# EAGLE schematic working (EAGLE 7.7.0)

## Sheet 1 of 2
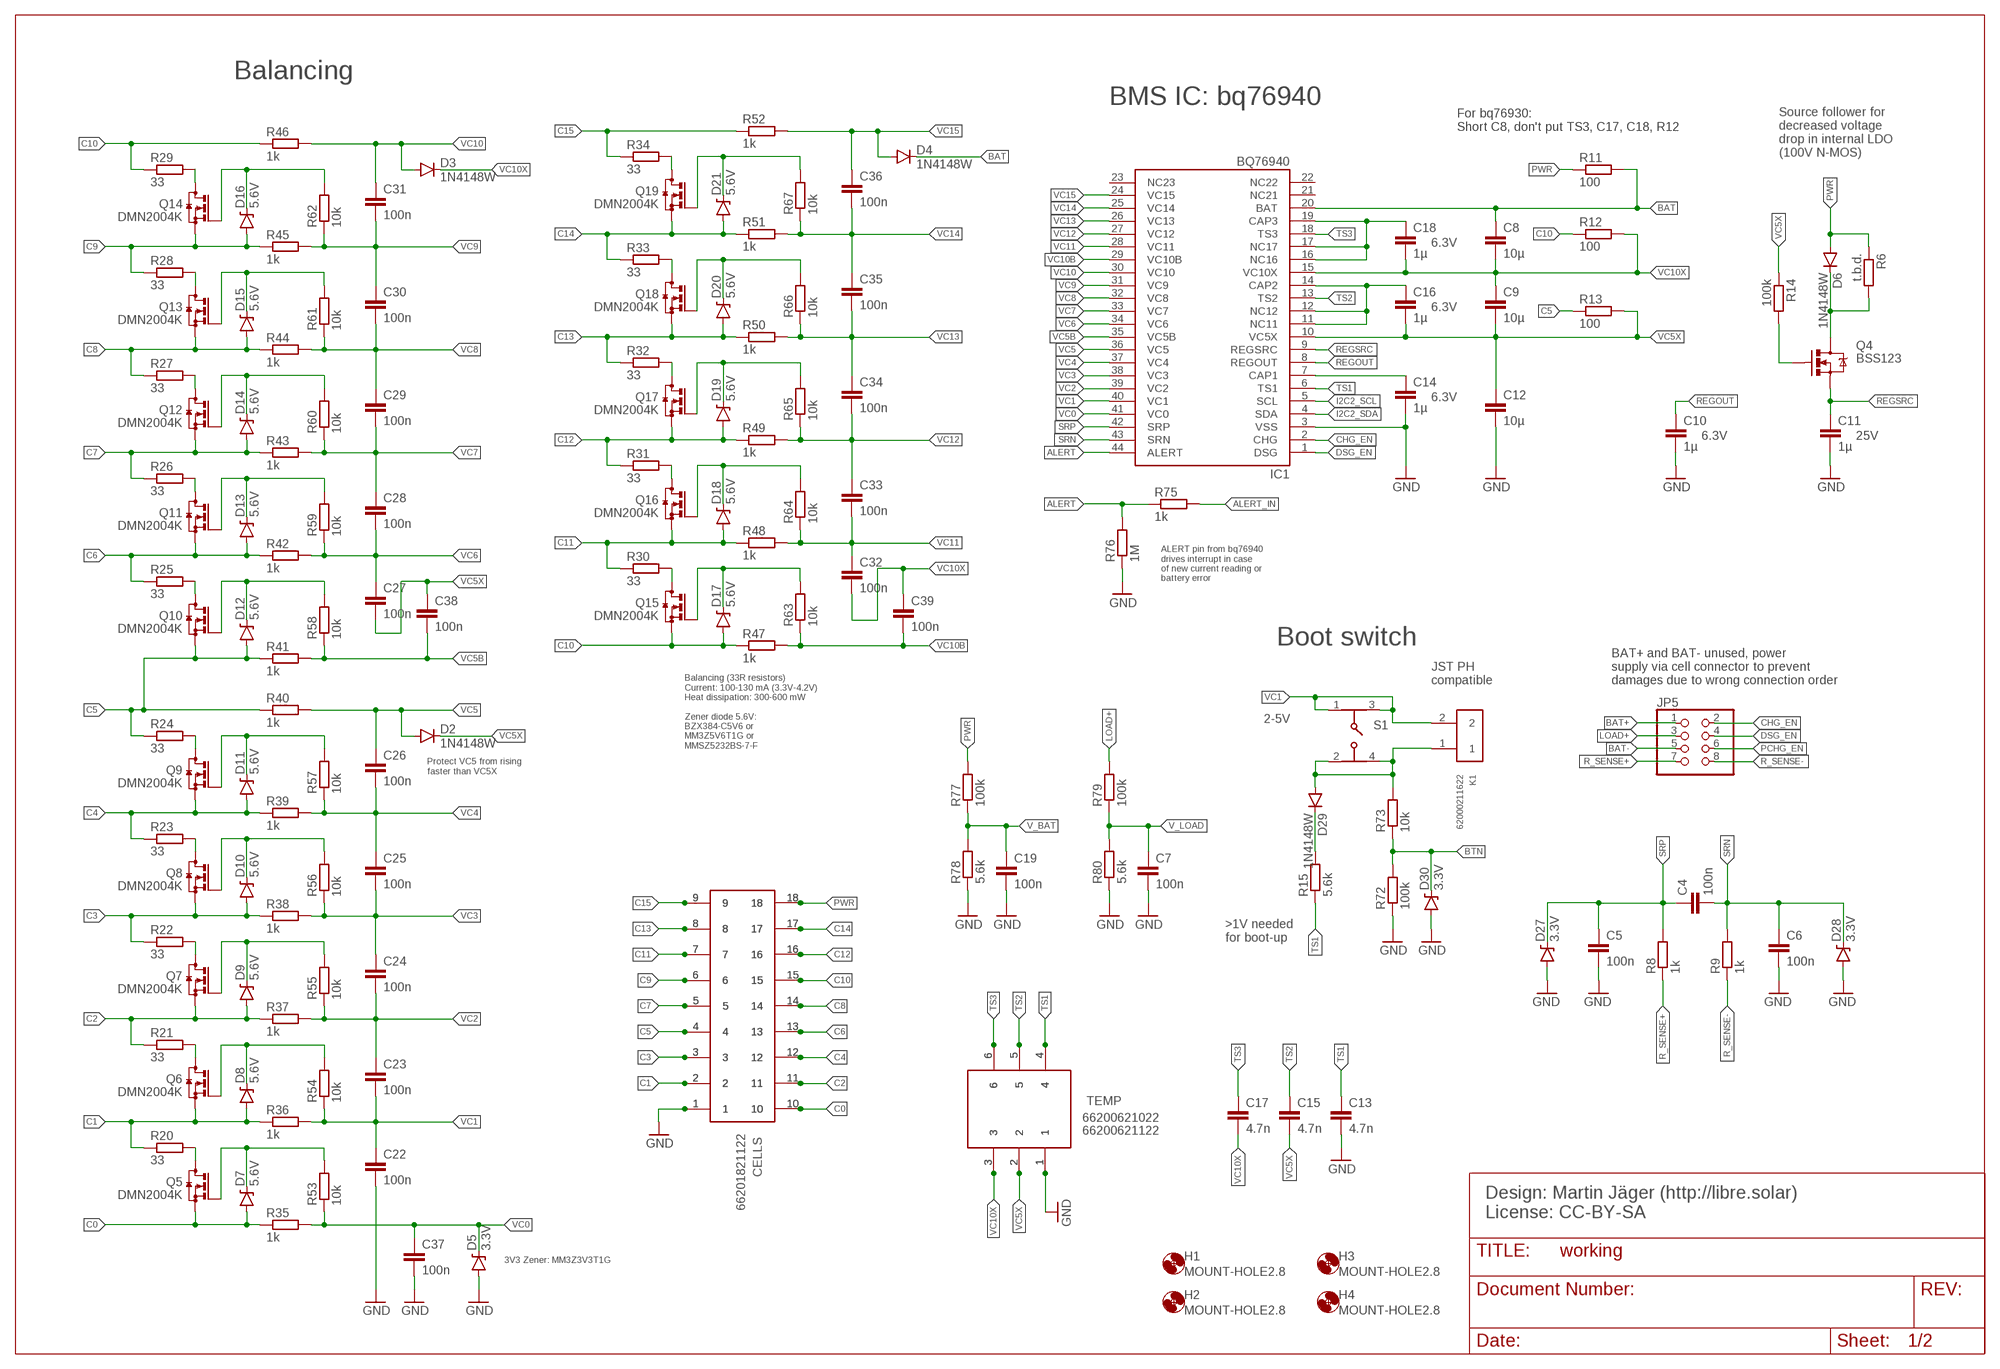
[diagram p0: schematic, sheet 1]

### Parts
C4  100n  C-EUC0603  [C0603]
C5  100n  C-EUC0603  [C0603]
C6  100n  C-EUC0603  [C0603]
C7  100n  C-EUC0603  [C0603]
C8  10µ  C-EUC1210  [C1210]
C9  10µ  C-EUC1210  [C1210]
C10  1µ  C-EUC0603  [C0603]
C11  1µ  C-EUC0603  [C0603]
C12  10µ  C-EUC1210  [C1210]
C13  4.7n  C-EUC0603  [C0603]
C14  1µ  C-EUC0603  [C0603]
C15  4.7n  C-EUC0603  [C0603]
C16  1µ  C-EUC0603  [C0603]
C17  4.7n  C-EUC0603  [C0603]
C18  1µ  C-EUC0603  [C0603]
C19  100n  C-EUC0603  [C0603]
C22  100n  C-EUC0603  [C0603]
C23  100n  C-EUC0603  [C0603]
C24  100n  C-EUC0603  [C0603]
C25  100n  C-EUC0603  [C0603]
C26  100n  C-EUC0603  [C0603]
C27  100n  C-EUC0603  [C0603]
C28  100n  C-EUC0603  [C0603]
C29  100n  C-EUC0603  [C0603]
C30  100n  C-EUC0603  [C0603]
C31  100n  C-EUC0603  [C0603]
C32  100n  C-EUC0603  [C0603]
C33  100n  C-EUC0603  [C0603]
C34  100n  C-EUC0603  [C0603]
C35  100n  C-EUC0603  [C0603]
C36  100n  C-EUC0603  [C0603]
C37  100n  C-EUC0603  [C0603]
C38  100n  C-EUC0603  [C0603]
C39  100n  C-EUC0603  [C0603]
CELLS  66201821022  [66201821022]
D2  1N4148W  DIODESOD123  [SOD-123]
D3  1N4148W  DIODESOD123  [SOD-123]
D4  1N4148W  DIODESOD123  [SOD-123]
D5  3.3V  DIODE-ZENER5.6V  [SOD-323]
D6  1N4148W  DIODESOD123  [SOD-123]
D7  5.6V  DIODE-ZENER5.6V  [SOD-323]
D8  5.6V  DIODE-ZENER5.6V  [SOD-323]
D9  5.6V  DIODE-ZENER5.6V  [SOD-323]
D10  5.6V  DIODE-ZENER5.6V  [SOD-323]
D11  5.6V  DIODE-ZENER5.6V  [SOD-323]
D12  5.6V  DIODE-ZENER5.6V  [SOD-323]
D13  5.6V  DIODE-ZENER5.6V  [SOD-323]
D14  5.6V  DIODE-ZENER5.6V  [SOD-323]
D15  5.6V  DIODE-ZENER5.6V  [SOD-323]
D16  5.6V  DIODE-ZENER5.6V  [SOD-323]
D17  5.6V  DIODE-ZENER5.6V  [SOD-323]
D18  5.6V  DIODE-ZENER5.6V  [SOD-323]
D19  5.6V  DIODE-ZENER5.6V  [SOD-323]
D20  5.6V  DIODE-ZENER5.6V  [SOD-323]
D21  5.6V  DIODE-ZENER5.6V  [SOD-323]
D27  3.3V  DIODE-ZENER5.6V  [SOD-323]
D28  3.3V  DIODE-ZENER5.6V  [SOD-323]
D29  1N4148W  DIODESOD123  [SOD-123]
D30  3.3V  DIODE-ZENER5.6V  [SOD-323]
H1  MOUNT-HOLE2.8  [2,8]
H2  MOUNT-HOLE2.8  [2,8]
H3  MOUNT-HOLE2.8  [2,8]
H4  MOUNT-HOLE2.8  [2,8]
IC1  BQ76940  [TSSOP44]
JP5  PINHD-2X4  [2X04]
K1  62000211622  [62000211622]
K4  66200621122  [66200621122]
K5  66201821122  [66201821122]
Q4  BSS123  MOSFET-NCHANNELBSS138  [SOT23-3]
Q5  DMN2004K  [SOT23]
Q6  DMN2004K  [SOT23]
Q7  DMN2004K  [SOT23]
Q8  DMN2004K  [SOT23]
Q9  DMN2004K  [SOT23]
Q10  DMN2004K  [SOT23]
Q11  DMN2004K  [SOT23]
Q12  DMN2004K  [SOT23]
Q13  DMN2004K  [SOT23]
Q14  DMN2004K  [SOT23]
Q15  DMN2004K  [SOT23]
Q16  DMN2004K  [SOT23]
Q17  DMN2004K  [SOT23]
Q18  DMN2004K  [SOT23]
Q19  DMN2004K  [SOT23]
R6  t.b.d.  R-EU_R0603  [R0603]
R8  1k  R-EU_R0603  [R0603]
R9  1k  R-EU_R0603  [R0603]
R11  100  R-EU_R0603  [R0603]
R12  100  R-EU_R0603  [R0603]
R13  100  R-EU_R0603  [R0603]
R14  100k  R-EU_R0603  [R0603]
R15  5.6k  R-EU_R0603  [R0603]
R20  33  R-EU_R2010  [R2010]
R21  33  R-EU_R2010  [R2010]
R22  33  R-EU_R2010  [R2010]
R23  33  R-EU_R2010  [R2010]
R24  33  R-EU_R2010  [R2010]
R25  33  R-EU_R2010  [R2010]
R26  33  R-EU_R2010  [R2010]
R27  33  R-EU_R2010  [R2010]
R28  33  R-EU_R2010  [R2010]
R29  33  R-EU_R2010  [R2010]
R30  33  R-EU_R2010  [R2010]
R31  33  R-EU_R2010  [R2010]
R32  33  R-EU_R2010  [R2010]
R33  33  R-EU_R2010  [R2010]
R34  33  R-EU_R2010  [R2010]
R35  1k  R-EU_R0603  [R0603]
R36  1k  R-EU_R0603  [R0603]
R37  1k  R-EU_R0603  [R0603]
R38  1k  R-EU_R0603  [R0603]
R39  1k  R-EU_R0603  [R0603]
R40  1k  R-EU_R0603  [R0603]
R41  1k  R-EU_R0603  [R0603]
R42  1k  R-EU_R0603  [R0603]
R43  1k  R-EU_R0603  [R0603]
R44  1k  R-EU_R0603  [R0603]
R45  1k  R-EU_R0603  [R0603]
R46  1k  R-EU_R0603  [R0603]
R47  1k  R-EU_R0603  [R0603]
R48  1k  R-EU_R0603  [R0603]
R49  1k  R-EU_R0603  [R0603]
R50  1k  R-EU_R0603  [R0603]
R51  1k  R-EU_R0603  [R0603]
R52  1k  R-EU_R0603  [R0603]
R53  10k  R-EU_R0603  [R0603]
R54  10k  R-EU_R0603  [R0603]
R55  10k  R-EU_R0603  [R0603]
R56  10k  R-EU_R0603  [R0603]
R57  10k  R-EU_R0603  [R0603]
R58  10k  R-EU_R0603  [R0603]
R59  10k  R-EU_R0603  [R0603]
R60  10k  R-EU_R0603  [R0603]
R61  10k  R-EU_R0603  [R0603]
R62  10k  R-EU_R0603  [R0603]
R63  10k  R-EU_R0603  [R0603]
R64  10k  R-EU_R0603  [R0603]
R65  10k  R-EU_R0603  [R0603]
R66  10k  R-EU_R0603  [R0603]
R67  10k  R-EU_R0603  [R0603]
R72  100k  R-EU_R0603  [R0603]
R73  10k  R-EU_R0603  [R0603]
R75  1k  R-EU_R0603  [R0603]
R76  1M  R-EU_R0603  [R0603]
R77  100k  R-EU_R0603  [R0603]
R78  5.6k  R-EU_R0603  [R0603]
R79  100k  R-EU_R0603  [R0603]
R80  5.6k  R-EU_R0603  [R0603]
S1  430182050816  [430182050816]
TEMP  66200621022  [66200621022]

### Nets
ALERT: IC1.44(ALERT) R75.1 R76.2
ALERT_IN: R75.2 ; also sheet 2
BAT: C8.1 D4.C IC1.20(BAT) R11.2
BAT+: JP5.1
BAT-: JP5.5
BTN: D30.C R72.2 R73.1 ; also sheet 2
C0: CELLS.10 D7.A K5.10 Q5.2(S) R35.1
C1: CELLS.2 D8.A K5.2 Q6.2(S) R20.1 R36.1
C2: CELLS.11 D9.A K5.11 Q7.2(S) R21.1 R37.1
C3: CELLS.3 D10.A K5.3 Q8.2(S) R22.1 R38.1
C4: CELLS.12 D11.A K5.12 Q9.2(S) R23.1 R39.1
C5: CELLS.4 D12.A K5.4 Q10.2(S) R13.1 R24.1 R40.1 R41.1
C6: CELLS.13 D13.A K5.13 Q11.2(S) R25.1 R42.1
C7: CELLS.5 D14.A K5.5 Q12.2(S) R26.1 R43.1
C8: CELLS.14 D15.A K5.14 Q13.2(S) R27.1 R44.1
C9: CELLS.6 D16.A K5.6 Q14.2(S) R28.1 R45.1
C10: CELLS.15 D17.A K5.15 Q15.2(S) R12.1 R29.1 R46.1 R47.1
C11: CELLS.7 D18.A K5.7 Q16.2(S) R30.1 R48.1
C12: CELLS.16 D19.A K5.16 Q17.2(S) R31.1 R49.1
C13: CELLS.8 D20.A K5.8 Q18.2(S) R32.1 R50.1
C14: CELLS.17 D21.A K5.17 Q19.2(S) R33.1 R51.1
C15: CELLS.9 K5.9 R34.1 R52.1
CAP1: C14.1 IC1.7(CAP1)
CAP2: C16.1 IC1.11(NC11) IC1.12(NC12) IC1.14(CAP2)
CAP3: C18.1 IC1.16(NC16) IC1.17(NC17) IC1.19(CAP3)
CHG_EN: IC1.2(CHG) JP5.2
DSG_EN: IC1.1(DSG) JP5.4
GND [power]: C5.2 C6.2 C7.2 C10.2 C11.2 C12.2 C13.2 C14.2 C19.2 C22.2 C37.2 CELLS.1 D5.A D27.A D28.A D30.A IC1.3(VSS) K4.1 K5.1 R72.1 R76.1 R78.1 R80.1 TEMP.1 ; also sheet 2
I2C2_SCL: IC1.5(SCL) ; also sheet 2
I2C2_SDA: IC1.4(SDA) ; also sheet 2
LOAD+ [power]: JP5.3 R79.2
MCU_IN: D29.A K1.1 R73.2 S1.2 S1.4
N$1: Q15.3(D) R30.2
N$2: Q16.3(D) R31.2
N$3: Q17.3(D) R32.2
N$4: D19.C Q17.1(G) R65.2
N$5: Q6.3(D) R21.2
N$7: D18.C Q16.1(G) R64.2
N$8: D7.C Q5.1(G) R53.2
N$10: D29.C R15.2
N$12: D8.C Q6.1(G) R54.2
N$13: D9.C Q7.1(G) R55.2
N$14: Q5.3(D) R20.2
N$15: Q7.3(D) R22.2
N$16: D10.C Q8.1(G) R56.2
N$17: Q8.3(D) R23.2
N$18: Q9.3(D) R24.2
N$19: D11.C Q9.1(G) R57.2
N$20: D12.C Q10.1(G) R58.2
N$21: Q10.3(D) R25.2
N$22: Q11.3(D) R26.2
N$24: D13.C Q11.1(G) R59.2
N$25: D14.C Q12.1(G) R60.2
N$27: Q12.3(D) R27.2
N$28: D15.C Q13.1(G) R61.2
N$29: Q13.3(D) R28.2
N$30: Q14.3(D) R29.2
N$31: D16.C Q14.1(G) R62.2
N$32: D17.C Q15.1(G) R63.2
N$33: D20.C Q18.1(G) R66.2
N$34: Q18.3(D) R33.2
N$35: D21.C Q19.1(G) R67.2
N$36: Q19.3(D) R34.2
N$49: D6.C Q4.3(D) R6.2
N$51: Q4.1(G) R14.2
PCHG_EN: JP5.6 ; also sheet 2
PWR: CELLS.18 D6.A K5.18 R6.1 R11.1 R77.2 ; also sheet 2
R_SENSE+ [power]: JP5.7 R8.1
R_SENSE-: JP5.8 R9.1
REGOUT: C10.1 IC1.8(REGOUT) ; also sheet 2
REGSRC: C11.1 IC1.9(REGSRC) Q4.2(S)
SRN: C4.2 C6.1 D28.C IC1.43(SRN) R9.2
SRP: C4.1 C5.1 D27.C IC1.42(SRP) R8.2
TS1: C13.1 IC1.6(TS1) K4.4 R15.1 TEMP.4 ; also sheet 2
TS2: C15.1 IC1.13(TS2) K4.5 TEMP.5
TS3: C17.1 IC1.18(TS3) K4.6 TEMP.6
V_BAT: C19.1 R77.1 R78.2 ; also sheet 2
V_LOAD: C7.1 R79.1 R80.2 ; also sheet 2
VC0: C37.1 D5.C IC1.41(VC0) R35.2 R53.1
VC1: C22.1 C23.2 IC1.40(VC1) K1.2 R36.2 R54.1 S1.1 S1.3
VC2: C23.1 C24.2 IC1.39(VC2) R37.2 R55.1
VC3: C24.1 C25.2 IC1.38(VC3) R38.2 R56.1
VC4: C25.1 C26.2 IC1.37(VC4) R39.2 R57.1
VC5: C26.1 D2.A IC1.36(VC5) R40.2
VC5B: C38.2 IC1.35(VC5B) R41.2 R58.1
VC5X: C9.2 C12.1 C15.2 C16.2 C27.2 C38.1 D2.C IC1.10(VC5X) K4.2 R13.2 R14.1 TEMP.2
VC6: C27.1 C28.2 IC1.34(VC6) R42.2 R59.1
VC7: C28.1 C29.2 IC1.33(VC7) R43.2 R60.1
VC8: C29.1 C30.2 IC1.32(VC8) R44.2 R61.1
VC9: C30.1 C31.2 IC1.31(VC9) R45.2 R62.1
VC10: C31.1 D3.A IC1.30(VC10) R46.2
VC10B: C39.2 IC1.29(VC10B) R47.2 R63.1
VC10X: C8.2 C9.1 C17.2 C18.2 C32.2 C39.1 D3.C IC1.15(VC10X) K4.3 R12.2 TEMP.3
VC11: C32.1 C33.2 IC1.28(VC11) R48.2 R64.1
VC12: C33.1 C34.2 IC1.27(VC12) R49.2 R65.1
VC13: C34.1 C35.2 IC1.26(VC13) R50.2 R66.1
VC14: C35.1 C36.2 IC1.25(VC14) R51.2 R67.1
VC15: C36.1 D4.A IC1.24(VC15) R52.2
Unconnected: IC1.21(NC21) IC1.22(NC22) IC1.23(NC23)

### Notes on the sheet
- Balancing
- BMS IC: bq76940
- For bq76930:
  Short C8, don't put TS3, C17, C18, R12
- Source follower for
  decreased voltage
  drop in internal LDO
  (100V N-MOS)
- 6.3V
- 6.3V
- 6.3V
- 6.3V | 25V
- ALERT pin from bq76940
  drives interrupt in case
  of new current reading or 
  battery error
- Boot switch
- JST PH
  compatible
- BAT+ and BAT- unused, power
  supply via cell connector to prevent
  damages due to wrong connection order
- 2-5V
- Balancing (33R resistors)
  Current: 100-130 mA (3.3V-4.2V)
  Heat dissipation: 300-600 mW
  
  Zener diode 5.6V:
  BZX384-C5V6 or
  MM3Z5V6T1G or
  MMSZ5232BS-7-F
- Protect VC5 from rising 
  faster than VC5X
- >1V needed
  for boot-up
- Design: Martin Jäger (http://libre.solar)
  License: CC-BY-SA
- 3V3 Zener: MM3Z3V3T1G

## Sheet 2 of 2
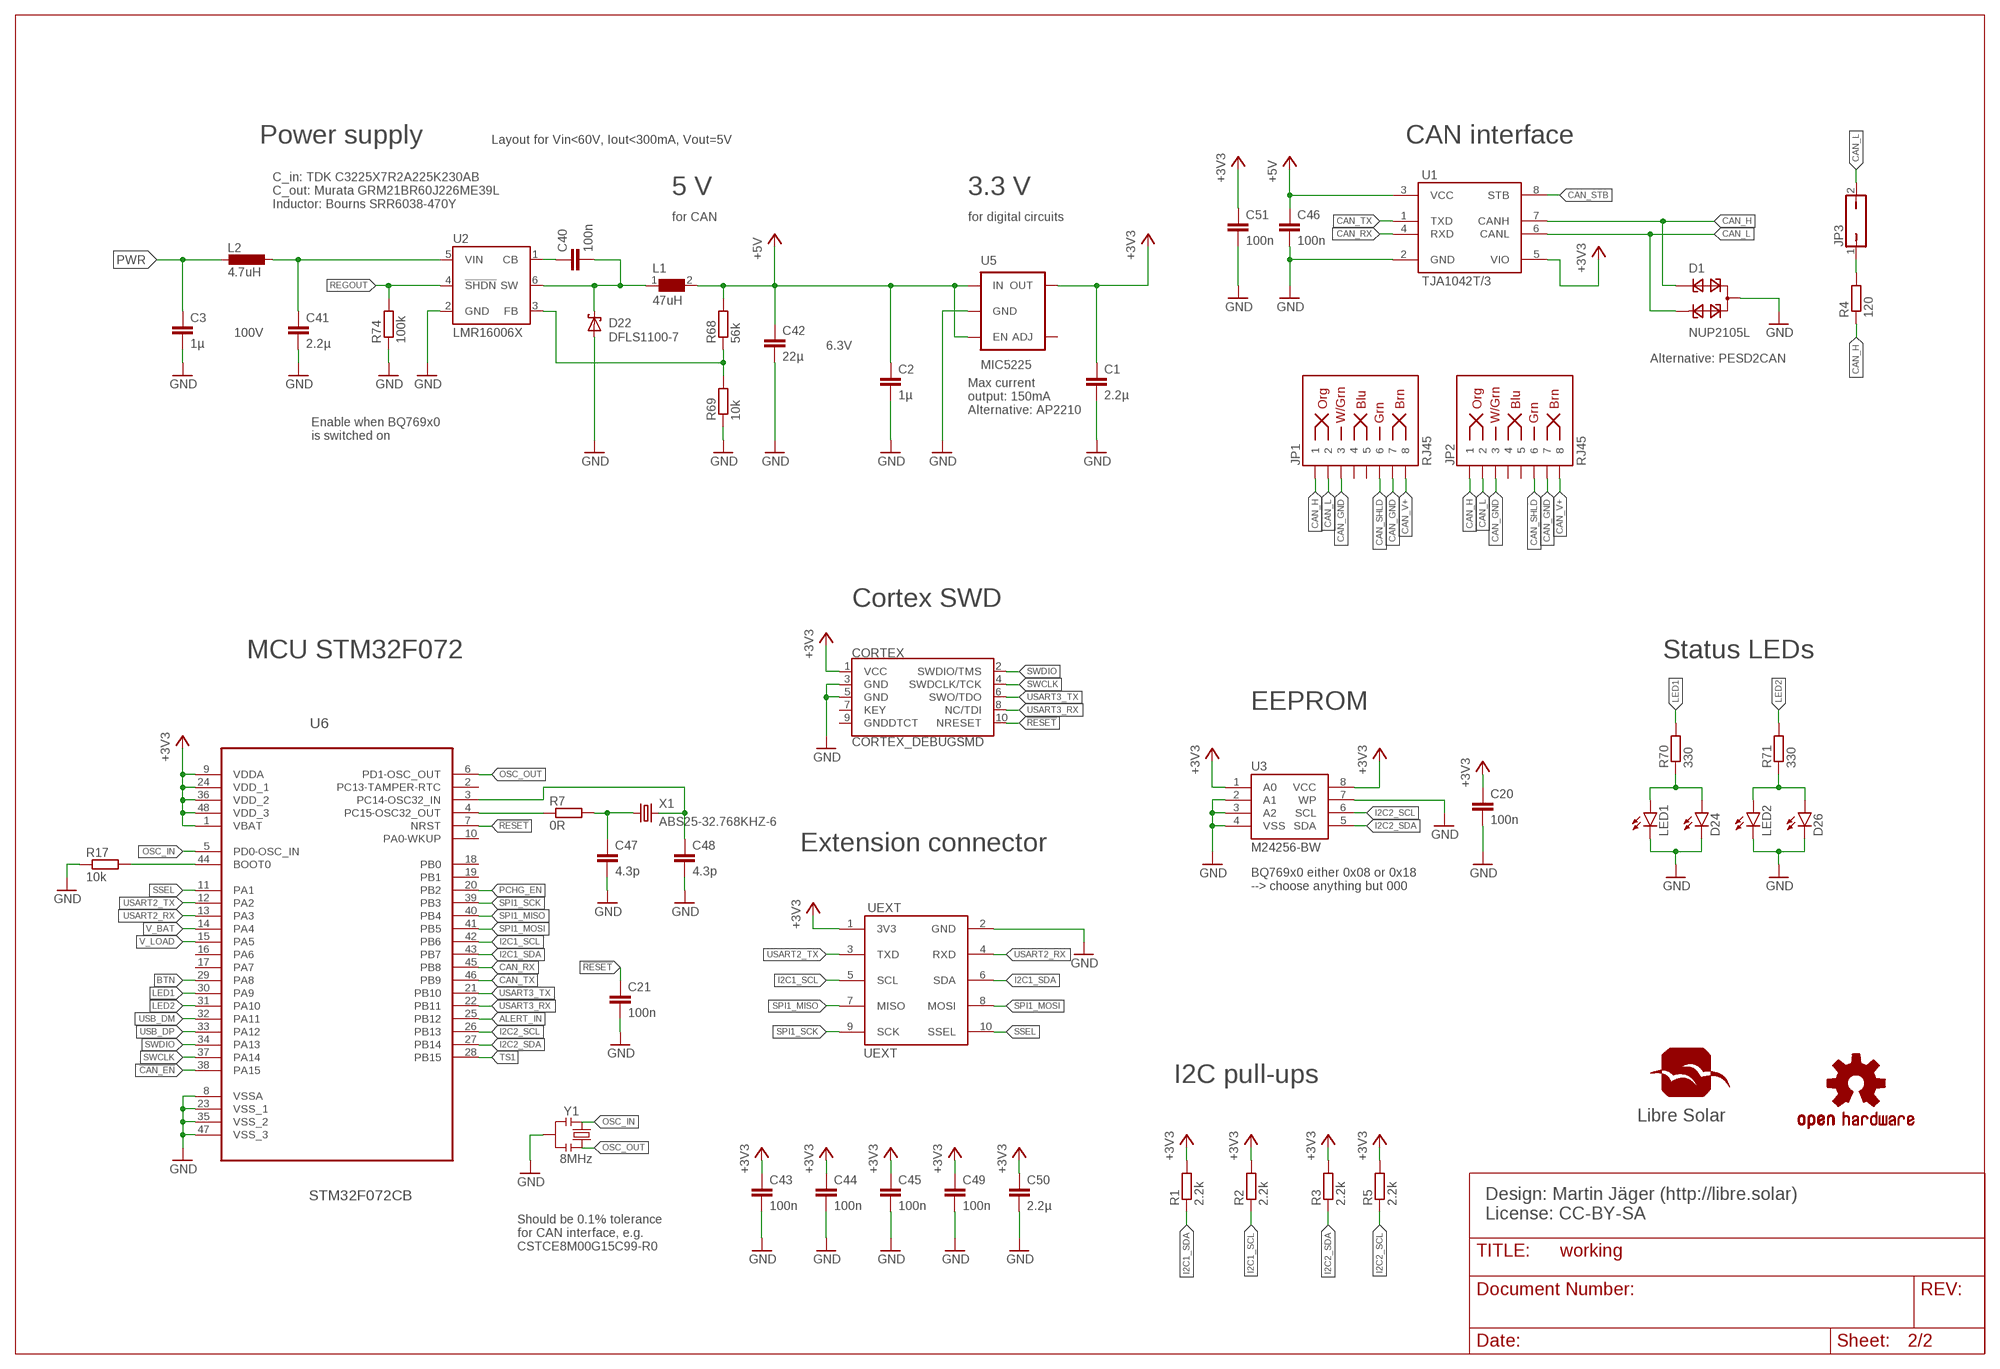
[diagram p1: schematic, sheet 2]

### Parts
C1  2.2µ  C-EUC0603  [C0603]
C2  1µ  C-EUC0603  [C0603]
C3  1µ  C-EUC0805  [C0805]
C20  100n  C-EUC0603  [C0603]
C21  100n  C-EUC0603  [C0603]
C40  100n  C-EUC0603  [C0603]
C41  2.2µ  C-EUC1210  [C1210]
C42  22µ  C-EUC0805  [C0805]
C43  100n  C-EUC0603  [C0603]
C44  100n  C-EUC0603  [C0603]
C45  100n  C-EUC0603  [C0603]
C46  100n  C-EUC0603  [C0603]
C47  4.3p  C-EUC0603  [C0603]
C48  4.3p  C-EUC0603  [C0603]
C49  100n  C-EUC0603  [C0603]
C50  2.2µ  C-EUC0603  [C0603]
C51  100n  C-EUC0603  [C0603]
CORTEX  CORTEX_DEBUGSMD  [SAMTECH_FTSH-105-01]
D1  NUP2105L  PESD2CAN  [SOT23]
D22  DFLS1100-7  SCHOTTKY-DIODEPOWERDI123  [POWERDI123]
D24  LED0603  [LED-0603]
D26  LED0603  [LED-0603]
JP1  RJ45  RJ45-8PTH  [RJ45-8]
JP2  RJ45  RJ45-8PTH  [RJ45-8]
JP3  JP1Q  [JP1]
L1  47uH  WE-TPC_6823  [WE-TPC_6823]
L2  4.7uH  L-EUL2012C  [L2012C]
LED1  LED3MM  [LED3MM]
LED2  LED3MM  [LED3MM]
N1  OSHW-LOGOM  [OSHW-LOGO-M]
R1  2.2k  R-EU_R0603  [R0603]
R2  2.2k  R-EU_R0603  [R0603]
R3  2.2k  R-EU_R0603  [R0603]
R4  120  R-EU_R1206  [R1206]
R5  2.2k  R-EU_R0603  [R0603]
R7  0R  R-EU_R0603  [R0603]
R17  10k  R-EU_R0603  [R0603]
R68  56k  R-EU_R0603  [R0603]
R69  10k  R-EU_R0603  [R0603]
R70  330  R-EU_R0603  [R0603]
R71  330  R-EU_R0603  [R0603]
R74  100k  R-EU_R0603  [R0603]
U1  TJA1042T/3  [SOIC-8-N]
U2  LMR16006X  LMR16006SOT-23  [SOT23-6]
U3  M24256-BW  EEPROM-I2CSMD  [SO08]
U5  MIC5225  V_REG_MIC5235  [SOT23-5]
U6  STM32F072CB  [QFP50P900X900X160-48N]
U$1  LIBRESOLAR_LOGO  [LIBRESOLAR_LOGO]
UEXT  UEXT  [UEXT]
X1  ABS25-32.768KHZ-6  CRYSTALMM20SS  [MM20SS]
Y1  8MHz  RESONATOR1:1  [RESONATOR-SMD-1:1]

### Nets
!CAN_EN!: U6.38(PA15)
!RESET: C21.1 CORTEX.10(NRESET) U6.7(NRST)
+3V3: C1.1 C20.1 C43.1 C44.1 C45.1 C49.1 C50.1 C51.1 CORTEX.1(VCC) R1.2 R2.2 R3.2 R5.2 U1.5(VIO) U3.1(A0) U3.8(VCC) U5.5(OUT) U6.1(VBAT) U6.9(VDDA) U6.24(VDD_1) U6.36(VDD_2) U6.48(VDD_3) UEXT.1(3V3)
+5V: C2.1 C42.1 C46.1 L1.2 R68.2 U1.3(VCC) U5.1(IN) U5.3(EN)
ALERT_IN: U6.25(PB12) ; also sheet 1
BTN: U6.29(PA8) ; also sheet 1
CAN_GND: JP1.3 JP1.7 JP2.3 JP2.7
CAN_H: D1.1 JP1.1 JP2.1 R4.1 U1.7(CANH)
CAN_L: D1.2 JP1.2 JP2.2 JP3.2 U1.6(CANL)
CAN_RX: U1.4(RXD) U6.45(PB8)
CAN_SHLD: JP1.6 JP2.6
CAN_STB: U1.8(STB)
CAN_TX: U1.1(TXD) U6.46(PB9)
CAN_V+: JP1.8 JP2.8
GND [power]: C1.2 C2.2 C3.2 C20.2 C21.2 C41.2 C42.2 C43.2 C44.2 C45.2 C46.2 C47.2 C48.2 C49.2 C50.2 C51.2 CORTEX.3(GND) CORTEX.5(GND) D1.3 D22.A D24.C D26.C LED1.K(C) LED2.K(C) R17.1 R69.1 R74.1 U1.2(GND) U2.2(GND) U3.2(A1) U3.3(A2) U3.4(VSS) U3.7(WP) U5.2(GND) U6.8(VSSA) U6.23(VSS_1) U6.35(VSS_2) U6.47(VSS_3) UEXT.2(GND) Y1.2 ; also sheet 1
I2C1_SCL: R2.1 U6.42(PB6) UEXT.5(SCL)
I2C1_SDA: R1.1 U6.43(PB7) UEXT.6(SDA)
I2C2_SCL: R5.1 U3.6(SCL) U6.26(PB13) ; also sheet 1
I2C2_SDA: R3.1 U3.5(SDA) U6.27(PB14) ; also sheet 1
LED1: R70.2 U6.30(PA9)
LED2: R71.2 U6.31(PA10)
N$9: C41.1 L2.1 U2.5(VIN)
N$11: R68.1 R69.2 U2.3(FB)
N$37: C40.2 D22.C L1.1 U2.6(SW)
N$39: C40.1 U2.1(CB)
N$40: JP3.1 R4.2
N$41: R7.1 U6.4(PC15-OSC32_OUT)
N$42: C47.1 R7.2 X1.1
N$43: D24.A LED1.A R70.1
N$44: C48.1 U6.3(PC14-OSC32_IN) X1.4
N$46: D26.A LED2.A R71.1
N$57: R17.2 U6.44(BOOT0)
OSC_IN: U6.5(PD0-OSC_IN) Y1.1
OSC_OUT: U6.6(PD1-OSC_OUT) Y1.3
PCHG_EN: U6.20(PB2) ; also sheet 1
PWR: C3.1 L2.2 ; also sheet 1
REGOUT: R74.2 U2.4(!SHDN!) ; also sheet 1
SPI1_MISO: U6.40(PB4) UEXT.7(MISO)
SPI1_MOSI: U6.41(PB5) UEXT.8(MOSI)
SPI1_SCK: U6.39(PB3) UEXT.9(SCK)
SSEL: U6.11(PA1) UEXT.10(SSEL)
SWCLK: CORTEX.4(SWDCLK/TCK) U6.37(PA14)
SWDIO: CORTEX.2(SWDIO/TMS) U6.34(PA13)
TS1: U6.28(PB15) ; also sheet 1
USART2_RX: U6.13(PA3) UEXT.4(RXD)
USART2_TX: U6.12(PA2) UEXT.3(TXD)
USART3_RX: CORTEX.8(NC/TDI) U6.22(PB11)
USART3_TX: CORTEX.6(SWO/TDO) U6.21(PB10)
USB_DM: U6.32(PA11)
USB_DP: U6.33(PA12)
V_BAT: U6.14(PA4) ; also sheet 1
V_LOAD: U6.15(PA5) ; also sheet 1
Unconnected: CORTEX.7(KEY) CORTEX.9(GNDDTCT) JP1.4 JP1.5 JP2.4 JP2.5 U5.4(ADJ) U6.2(PC13-TAMPER-RTC) U6.10(PA0-WKUP) U6.16(PA6) U6.17(PA7) U6.18(PB0) U6.19(PB1)

### Notes on the sheet
- Power supply | Layout for Vin<60V, Iout<300mA, Vout=5V | CAN interface
- 5 V | 3.3 V
- C_in: TDK C3225X7R2A225K230AB
  C_out: Murata GRM21BR60J226ME39L
  Inductor: Bourns SRR6038-470Y
- for CAN | for digital circuits
- 100V
- 6.3V
- Alternative: PESD2CAN
- Max current 
  output: 150mA
  Alternative: AP2210
- Enable when BQ769x0
  is switched on
- Cortex SWD
- MCU STM32F072 | Status LEDs
- EEPROM
- Extension connector
- BQ769x0 either 0x08 or 0x18
  --> choose anything but 000
- I2C pull-ups
- Design: Martin Jäger (http://libre.solar)
  License: CC-BY-SA
- Should be 0.1% tolerance
  for CAN interface, e.g.
  CSTCE8M00G15C99-R0

## Library data of the parts
C1 C10 C50 = rcl:C-EU: CAPACITOR, European symbol; MF: AVX; MPN: 0805YC475KAT2A; OC_FARNELL: 1657937
C2 C3 = rcl:C-EU: CAPACITOR, European symbol; MF: AVX; MPN: 08055C104KAT2A; OC_FARNELL: 499687
C4-C7 C13 C15 C17 C19 C22-C40 = rcl:C-EU: CAPACITOR, European symbol; MF: WALSIN; MPN: 0603B104K500CT; OC_FARNELL: 2496834
C8 C9 C12 = rcl:C-EU: CAPACITOR, European symbol; MF: MURATA; MPN: GRM32ER7YA106KA12L; OC_FARNELL: 1735537
C11 C14 C16 C18 = rcl:C-EU: CAPACITOR, European symbol; MF: MURATA; MPN: GRM188R71E105KA12D; OC_FARNELL: 1735540
C20 C21 C43-C45 C47-C49 = rcl:C-EU: CAPACITOR, European symbol; MF: MURATA; MPN: GRM188R71H104KA93D; OC_FARNELL: 8820023
C41 = rcl:C-EU: CAPACITOR, European symbol; MF: TDK; MPN: C3225X7R2A225K230AB; OC_FARNELL: 2112727
C42 = rcl:C-EU: CAPACITOR, European symbol; MF: MURATA; MPN: GRM21BR60J226ME39L; OC_FARNELL: 1735531
C46 C51 = rcl:C-EU: CAPACITOR, European symbol; MF: AVX; MPN: 06035C104KAT2A; OC_FARNELL: 1301804
CELLS = Wire_to_Board_Connectors_rev15d:66201821022: WR-MPC3 3.00mm Male Dual Row Angled Header with Plastic Pegs, 18 Pins=>Code : Con_WTB-MPC3_2_PCB_THT66201821022 <http://katalog.we-online.de/media/thumbs2/eican/thb_Con_WTB-MPC3_2_PCB_THT86220xx21022_pf2.jpg> Details see: http://katalog.we-online.de/en/em/662_0xx_210_22 Created 2014-06-06, Karrer Zheng 2014 (C) Würth Elektronik
CORTEX = LibreSolar:CORTEX_DEBUG: Cortex Debug Connector Datasheet <http://infocenter.arm.com/help/topic/com.arm.doc.faqs/attached/13634/cortex_debug_connectors.pdf>
D1 = LibreSolar:PESD2CAN: CAN bus ESD protection diode Source: http://www.nxp.com/documents/data_sheet/PESD1CAN.pdf; MF: NXP; MPN: PESD2CAN; OC_FARNELL: 1510712
D2-D4 D6 D29 = SparkFun-DiscreteSemi:DIODE: Diode These are standard reverse protection diodes and small signal diodes. SMA package can handle up to about 1A. SOD-323 can handle about 200mA. What the SOD-323 package when ordering, there are some mfgs out there that are 5-pin packages.; MF: DIODES INC.; MPN: 1N4148W-7-F.; OC_FARNELL: 1776392
D5 D27 D28 D30 = SparkFun-DiscreteSemi:DIODE-ZENER: Zener Diode Production Part - 8199 3.4V Zener Voltage; MF: NXP; MPN: BZX384-C5V6; OC_FARNELL: 8735743; PROD_ID: DIO-12442; VALUE: 5.6V
D7-D21 = SparkFun-DiscreteSemi:DIODE-ZENER: Zener Diode Production Part - 8199 3.4V Zener Voltage; MF: NXP; MPN: BZX384-C5V6; OC_FARNELL: 8735743; PROD_ID: DIO-12442
D22 = resolut:SCHOTTKY-DIODE: Schottky Diode; MF: DIODES INC.; MPN: DFLS1100-7; OC_FARNELL: 1713889
D24 D26 LED1 LED2 = SparkFun-LED:LED: LEDs Standard schematic elements and footprints for 5mm, 3mm, 1206, and 0603 sized LEDs. 5mm - Spark Fun Electronics SKU : COM-00529 (and others); OC_FARNELL: unknown
H1-H4 = holes:MOUNT-HOLE: MOUNTING HOLE with drill center marker; OC_FARNELL: unknown
IC1 = LibreSolar:BQ76940; MF: TEXAS INSTRUMENTS; MPN: BQ7694003DBT; OC_FARNELL: 2425791
JP1 JP2 = SparkFun-Connectors:RJ45-8: RJ45 Jack Simple RJ45, 8-pin connection - connector for common Cat5, Cat5e, and Cat6 Ethernet cables. Footprint not yet proven in production. Connector sku is PRT-00643; Breakout PCB sku is BOB-00716.; MF: AMPHENOL COMMERCIAL PRODUCTS; MPN: RJHSE-5080; OC_FARNELL: 1860577; PROD_ID: CONN-08506
JP3 = jumper:JP1Q: JUMPER
JP5 = pinhead:PINHD-2X4: PIN HEADER
K1 = Wire_to_Board_Connectors_rev15d:62000211622: WR-WTB 2.00mm Male Vertical Shrouded Header, 2 Pins=>Code : Con_WTB_2.00_PCB_THT_62000211622 <http://katalog.we-online.de/media/thumbs2/eican/thb_Con_WTB_2.00_PCB_THT_6200xx11622_pf2.jpg> Details see: http://katalog.we-online.de/en/em/620_0xx_116_22 Created 2014-06-05, Karrer Zheng 2014 (C) Würth Elektronik
K4 = Wire_to_Board_Connectors_rev15d:66200621122: WR-MPC3 3.00mm Male Dual Row Vertical Header, 6 Pins=>Code : Con_WTB_MPC3_2_PCB_THT_66200621122 <http://katalog.we-online.de/media/thumbs2/eican/thb_Con_WTB_MPC3_2_PCB_THT_6620xx21122_pf2.jpg> Details see: http://katalog.we-online.de/en/em/662_0xx_211_22 Created 2014-06-06, Karrer Zheng 2014 (C) Würth Elektronik
K5 = Wire_to_Board_Connectors_rev15d:66201821122: WR-MPC3 3.00mm Male Dual Row Vertical Header, 18 Pins=>Code : Con_WTB_MPC3_2_PCB_THT_66201821122 <http://katalog.we-online.de/media/thumbs2/eican/thb_Con_WTB_MPC3_2_PCB_THT_6620xx21122_pf2.jpg> Details see: http://katalog.we-online.de/en/em/662_0xx_211_22 Created 2014-06-06, Karrer Zheng 2014 (C) Würth Elektronik
L1 = PowerMagnetics:WE-TPC: Shielded Tiny Power Inductor WE-TPC - Extremely flat power inductor - High current capability - High reliability and perfect soldering characteristics because of integrated soldering pad - magnetically shielded -- Portable power like PDA, digital camera, PCMICA-cards and displays -- DC/DC-converter -- Recommended for switching regulator IC's from Linear Technology, National Semiconductor, Texas Instruments and Fairchild Semiconductor <http://katalog.we-online.de/media/images/eisos/IndTPC_pf2.jpg> Details see: http://katalog.we-online.de/en/pbs/WE-TPC? Updated by Dan Xu 2014-07-11 2014 (C) Würth Elektronik
L2 = rcl:L-EU: INDUCTOR, European symbol
N1 = resolut:OSHW-LOGO: Open Source Hardware Logo This logo indicates the piece of hardware it is found on incorporates a OSHW license and/or adheres to the definition of open source hardware found here: http://freedomdefined.org/OSHW; OC_FARNELL: unknown
Q4 = SparkFun-DiscreteSemi:MOSFET-NCHANNEL: Common NMOSFET Parts MFG P/N Store ID Prod ID FDD8780 TRANS-09984 SI7820DN TRANS-11055 FDS6630A IC-08089 2N7002PW TRANS-11151 FQP30N06L COM-10213 TRANS-10060 BSS123LT1G TRANS-08345 BSS138 TRANS-00830 BS170 2N7000; MF: NXP; MPN: 2N7002,215; OC_FARNELL: 1510761; PROD_ID: TRANS-00830; VALUE: 200mA/50V
Q5-Q19 = resolut:DMN2004K: N-CHANNEL MOS FET with low VGS and ESD protection; MF: DIODES INC.; MPN: DMN2004K-7; OC_FARNELL: 1713842
R1-R3 R5 = rcl:R-EU_: RESISTOR, European symbol; MF: YAGEO (PHYCOMP); MPN: RC0603FR-072K2L.; OC_FARNELL: 9238522
R4 = rcl:R-EU_: RESISTOR, European symbol; MF: WELWYN; MPN: WCR0805-120RFI; OC_FARNELL: 1100308
R6 R8 R9 R11-R13 R15 R35-R52 R70-R73 R75 R77-R80 = rcl:R-EU_: RESISTOR, European symbol; MF: MULTICOMP; MPN: MCMR06X1001FTL; OC_FARNELL: 2073348
R7 R17 = rcl:R-EU_: RESISTOR, European symbol; MF: YAGEO (PHYCOMP); MPN: RC0603FR-0710KL; OC_FARNELL: 9238603
R14 = rcl:R-EU_: RESISTOR, European symbol; OC_FARNELL: unknown
R20-R34 = rcl:R-EU_: RESISTOR, European symbol; MF: WELWYN; MPN: ASC2010-33RFT4; OC_FARNELL: 2079038
R53-R67 R69 R74 = rcl:R-EU_: RESISTOR, European symbol; MF: PANASONIC ELECTRONIC COMPONENTS; MPN: ERJ3EKF1002V; OC_FARNELL: 2303192
R68 = rcl:R-EU_: RESISTOR, European symbol; MF: BOURNS; MPN: CR0805-FX-1001ELF; OC_FARNELL: 2008380
R76 = rcl:R-EU_: RESISTOR, European symbol; MF: PANASONIC ELECTRONIC COMPONENTS; MPN: ERJU06F1004V; OC_FARNELL: 2145441
S1 = EAGLE-TACT_SWITCHES-rev16e:430182050816: 6x6 mm SMD WS-TASV <http://katalog.we-online.de/media/images/v2/Family_WS-TASV_6x6mm_SMD_Tact_Switch_4301820xx8xx.jpg> Details see: http://katalog.we-online.de/em/datasheet/4301x2xxx8x6.pdf 2015 (C) Würth Elektronik
TEMP = Wire_to_Board_Connectors_rev15d:66200621022: WR-MPC3 3.00mm Male Dual Row Angled Header with Plastic Pegs, 6 Pins=>Code : Con_WTB-MPC3_2_PCB_THT66200621022 <http://katalog.we-online.de/media/thumbs2/eican/thb_Con_WTB-MPC3_2_PCB_THT86220xx21022_pf2.jpg> Details see: http://katalog.we-online.de/en/em/662_0xx_210_22 Created 2014-06-06, Karrer Zheng 2014 (C) Würth Elektronik
U1 = LibreSolar:TJA1042T/3: 3.3V CAN transceiver
U2 = resolut:LMR16006: LMR16006 SIMPLE SWITCHER® 60 V 0.6 A Buck Regulators With High Efficiency ECO Mode; MF: TEXAS INSTRUMENTS; MPN: LMR16006XDDCT; OC_FARNELL: 2455133; VALUE: LMR16006
U3 = SparkFun-DigitalIC:EEPROM-I2C: I2C EEPROM chips, 24LC256 (and others)
U5 = SparkFun-PowerIC:V_REG_MIC5235; MF: MICROCHIP; MPN: MIC5225-3.3YM5-TR; OC_FARNELL: 2510262
U6 = LibreSolar:STM32F072CB: ARM-based 32-bit MCU; MPN: STM32F100C4T6B; OC_FARNELL: 1838504; OC_NEWARK: 86R1309; PACKAGE: LQFP-48; SUPPLIER: STMircroelectronics
U$1 = LibreSolar:LIBRESOLAR_LOGO
UEXT = LibreSolar:UEXT: WR-BHD 2.54mm Male Box Header, 10 Pins=>Code : Con_WTB_BHD_2.54_Male_THT_WS_61201021621 <http://katalog.we-online.de/media/thumbs2/eican/thb_Con_WTB_BHD_2.54_Male_THT_WS_6120xx21621_pf2.jpg> Details see: http://katalog.we-online.de/en/em/612_0xx_216_21 Created 2014-06-04, Karrer Zheng 2014 (C) Würth Elektronik
X1 = crystal:CRYSTAL: CRYSTAL; OC_FARNELL: unknown; OC_NEWARK: unknown
Y1 = Testing:RESONATOR: Resonator Small SMD resonator. This is the itty bitty 10/20MHz resonators with built in caps. CSTCE10M0G55 and CSTCE20M0V53. Footprint for SMD has been used in SFE production for years, and does work okay. 1:1 is an attempt to get larger fillets on the sides so it will be easier to inspect these solders in our AOI machine. The pads have been minimized to match the actual metal under the resonator. To see this relation, it includes an image import of the bottom side of the component. Imported to scale on layer 200.; MF: MURATA; MPN: CSTCE8M00G15C99-R0

## Net classes
0 default: width 0.203 mm, drill 0.3 mm, clearance 0.152 mm
1 power: width 0.203 mm, drill 0.5 mm, clearance 0.152 mm
2 VIN: width 0.203 mm, drill 0.3 mm, clearance 0.152 mm